# EAGLE schematic MiniBOT New (EAGLE 8.2.1)
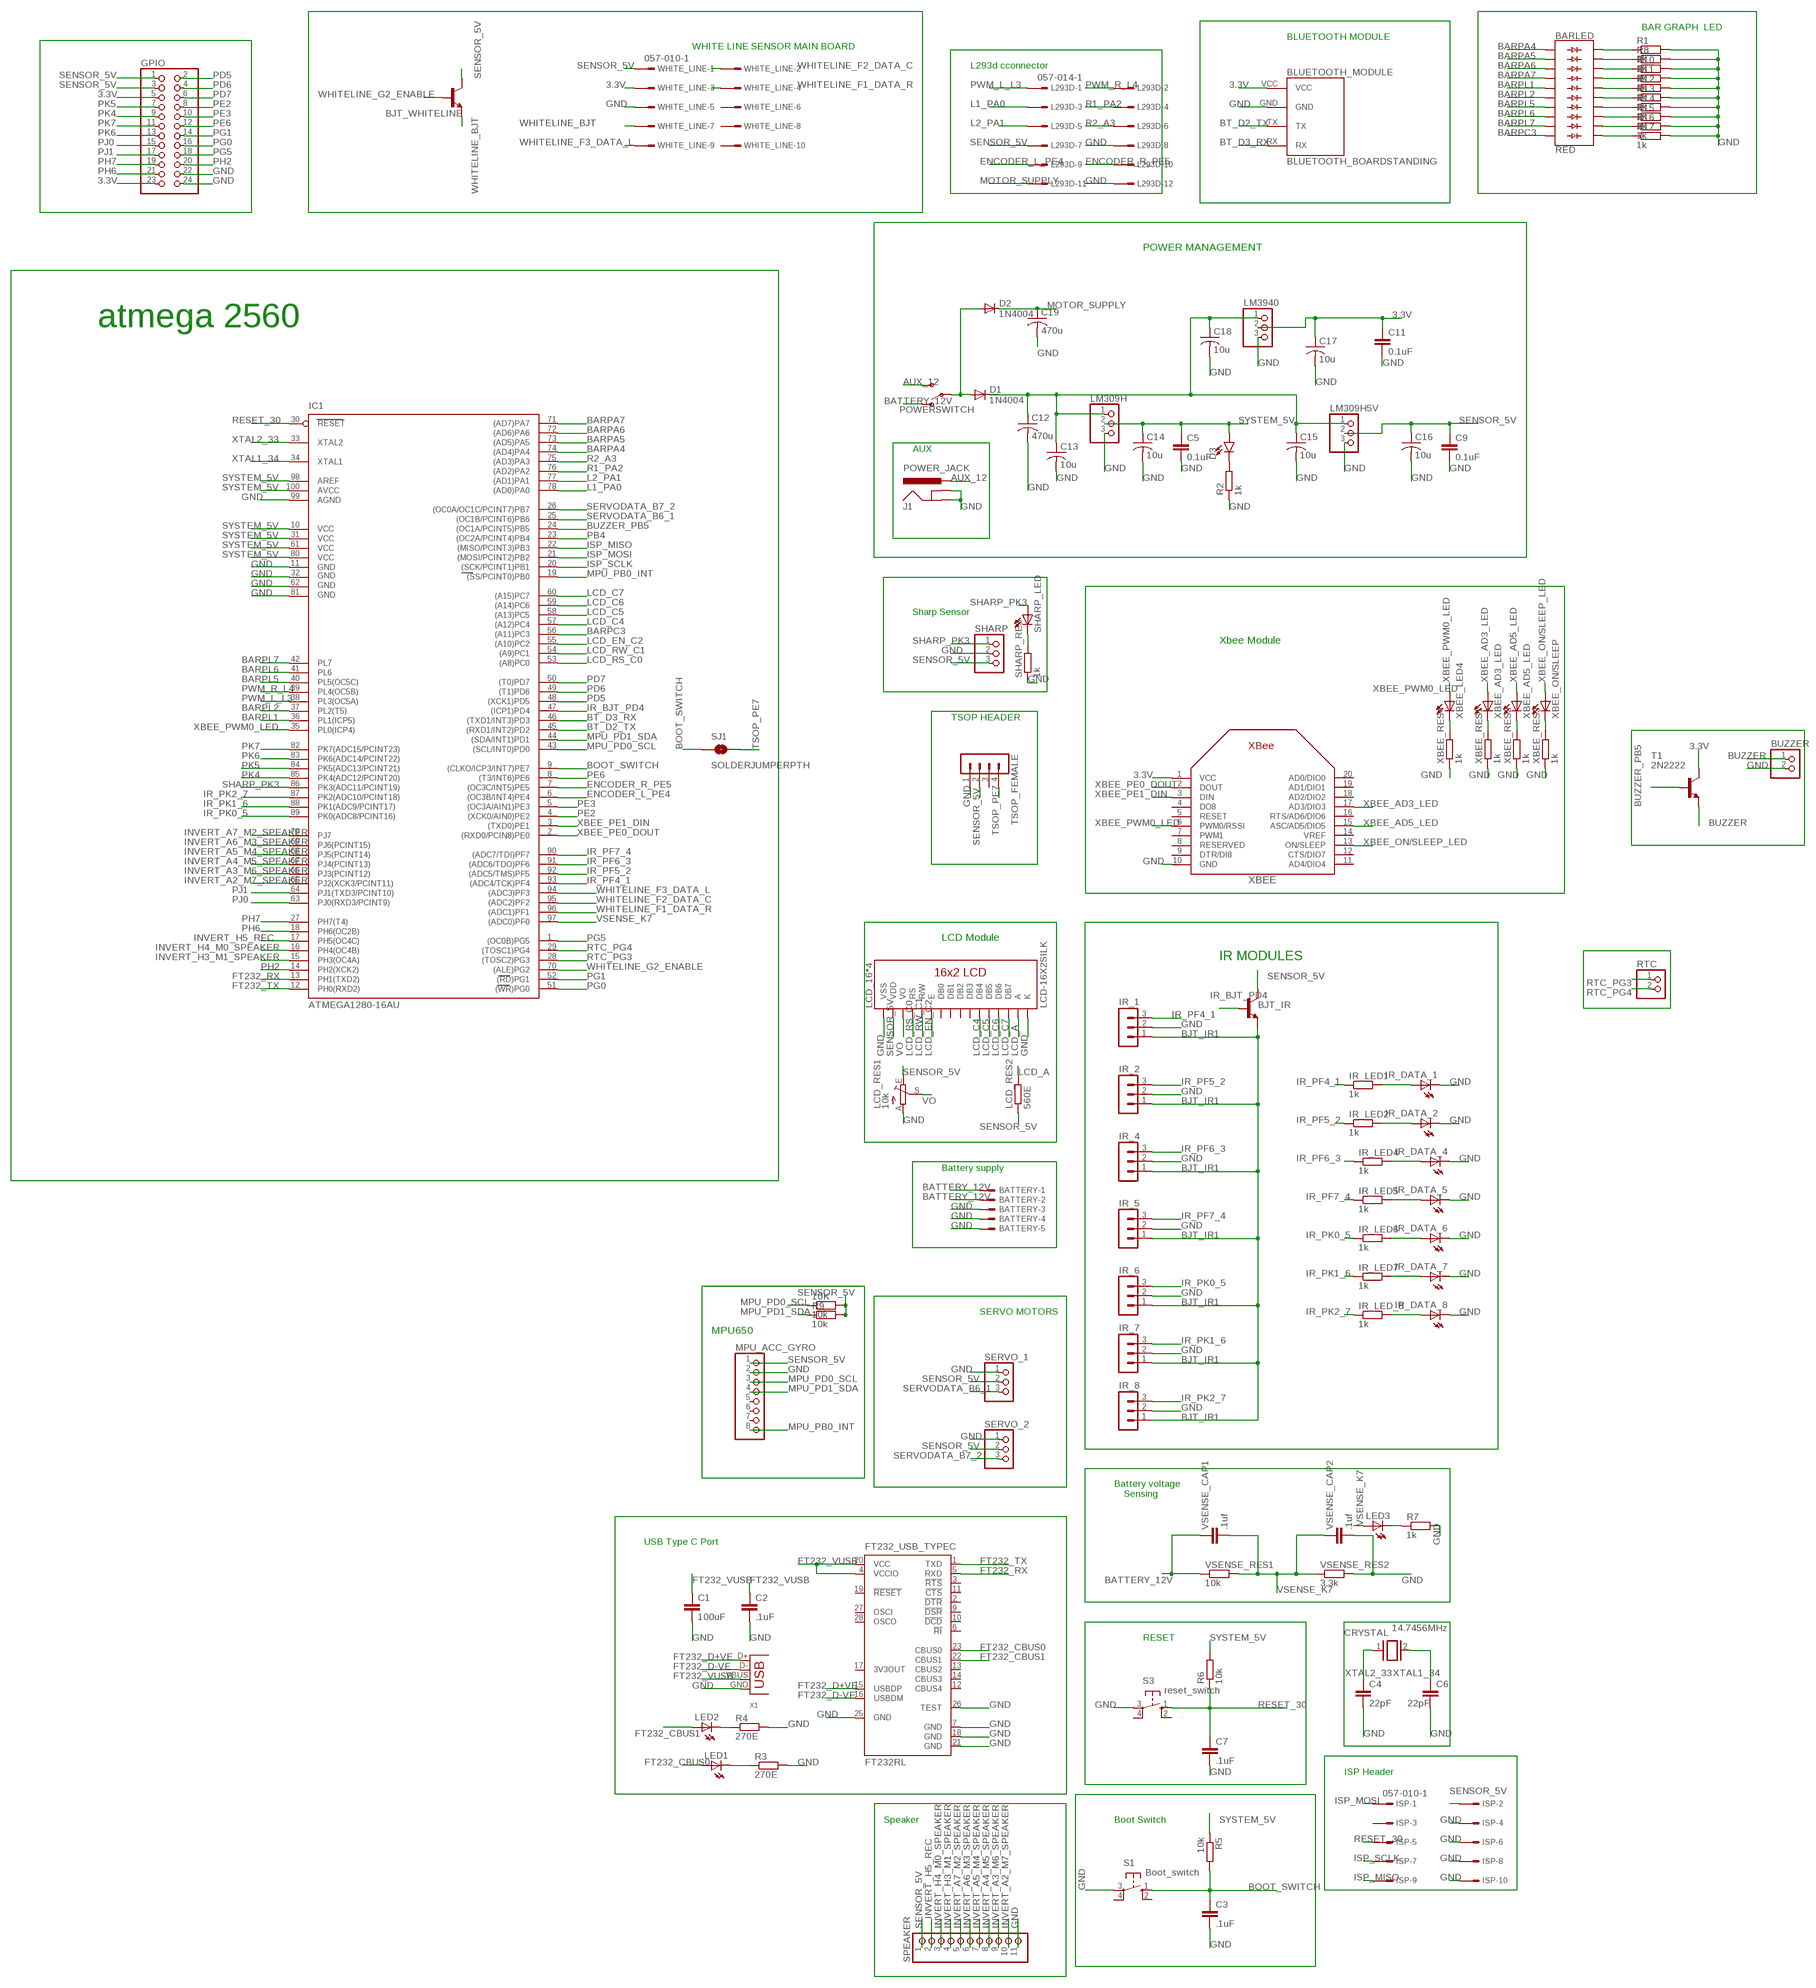
[diagram p0: schematic, sheet 1]

## Parts
10K  10k  R-EU_R1206  [R1206]
BARLED  RED  LED_BARGRAPH_10RED  [LED_BARGRAPH_10]
BATTERY  KK-156-5  [KK-156-5]
BJT_IR  2N2222  [TO92-EBC-OVAL]
BJT_WHITELINE  2N2222  [TO92-EBC-OVAL]
BLUETOOTH_MODULE  BLUETOOTH_BOARDSTANDING  [BT_BOARD_FOOTPRINT_STANDING]
BUZZER  PINHD-1X2  [1X02]
C1  100uF  C-EUC1206  [C1206]
C2  .1uF  C-EUC1206  [C1206]
C3  .1uF  C-EUC1206  [C1206]
C4  22pF  C-EUC1206  [C1206]
C5  0.1uF  C-EUC1206  [C1206]
C6  22pF  C-EUC1206  [C1206]
C7  .1uF  C-EUC1206  [C1206]
C9  0.1uF  C-EUC1206  [C1206]
C11  0.1uF  C-EUC1206  [C1206]
C12  470u  C-US025-050X050  [C025-050X050]
C13  10u  C-US025-050X050  [C025-050X050]
C14  10u  C-US025-050X050  [C025-050X050]
C15  10u  C-US025-050X050  [C025-050X050]
C16  10u  C-US025-050X050  [C025-050X050]
C17  10u  C-US025-050X050  [C025-050X050]
C18  10u  C-US025-050X050  [C025-050X050]
C19  470u  C-US025-050X050  [C025-050X050]
CRYSTAL  14.7456MHz  XTAL/S  [QS]
D1  1N4004  [DO41-10]
D2  1N4004  [DO41-10]
D3  LED1206  [LED-1206]
FT232_USB_TYPEC  FT232RL  [SSOP28]
GPIO  PINHD-2X12  [2X12]
IC1  ATMEGA1280-16AU  [TQFP100]
IR_1  MA03-1  [MA03-1]
IR_2  MA03-1  [MA03-1]
IR_4  MA03-1  [MA03-1]
IR_5  MA03-1  [MA03-1]
IR_6  MA03-1  [MA03-1]
IR_7  MA03-1  [MA03-1]
IR_8  MA03-1  [MA03-1]
IR_DATA_1  LEDSMT1206  [1206]
IR_DATA_2  LEDSMT1206  [1206]
IR_DATA_4  LEDSMT1206  [1206]
IR_DATA_5  LEDSMT1206  [1206]
IR_DATA_6  LEDSMT1206  [1206]
IR_DATA_7  LEDSMT1206  [1206]
IR_DATA_8  LEDSMT1206  [1206]
IR_LED1  1k  R-EU_R1206  [R1206]
IR_LED2  1k  R-EU_R1206  [R1206]
IR_LED4  1k  R-EU_R1206  [R1206]
IR_LED5  1k  R-EU_R1206  [R1206]
IR_LED6  1k  R-EU_R1206  [R1206]
IR_LED7  1k  R-EU_R1206  [R1206]
IR_LED_8  1k  R-EU_R1206  [R1206]
ISP  057-010-1  [057-010-1]
J1  POWER_JACK  [POWER_JACK_PTH]
L293D  057-014-1  [057-014-1]
LCD_16*4  LCD-16X2SILK  [LCD-16X2]
LCD_RES1  10k  TRIM_EU-CA6V  [CA6V]
LCD_RES2  560E  R-EU_R1206  [R1206]
LED1  LEDSMT1206  [1206]
LED2  LEDSMT1206  [1206]
LED3  LEDSMT1206  [1206]
LM309H  PINHD-1X3  [1X03]
LM309H5V  PINHD-1X3  [1X03]
LM3940  PINHD-1X3  [1X03]
MPU_ACC_GYRO  PINHD-1X8  [1X08]
POWERSWITCH  SWITCH-SPDT-PTH-11.6X4.0MM-LOCK  [SWITCH_SPDT_PTH_11.6X4.0MM_LOCK]
R1  1k  R-EU_R1206  [R1206]
R2  1k  R-EU_R1206  [R1206]
R3  270E  R-EU_R1206  [R1206]
R4  270E  R-EU_R1206  [R1206]
R5  10k  R-EU_R1206  [R1206]
R6  10k  R-EU_R1206  [R1206]
R7  1k  R-EU_R1206  [R1206]
R8  1k  R-EU_R1206  [R1206]
R9  10k  R-EU_R1206  [R1206]
R10  1k  R-EU_R1206  [R1206]
R11  1k  R-EU_R1206  [R1206]
R12  1k  R-EU_R1206  [R1206]
R13  1k  R-EU_R1206  [R1206]
R14  1k  R-EU_R1206  [R1206]
R15  1k  R-EU_R1206  [R1206]
R16  1k  R-EU_R1206  [R1206]
R17  1k  R-EU_R1206  [R1206]
RTC  PINHD-1X2  [1X02]
S1  Boot_switch  10-XX  [B3F-10XX]
S3  reset_switch  10-XX  [B3F-10XX]
SERVO_1  PINHD-1X3  [1X03]
SERVO_2  PINHD-1X3  [1X03]
SHARP  PINHD-1X3  [1X03]
SHARP_LED  LEDSMT1206  [1206]
SHARP_RES  1k  R-EU_R1206  [R1206]
SJ1  SOLDERJUMPERPTH  [SJ_2S-PTH]
SPEAKER  PINHD-1X11  [1X11]
T1  2N2222  [TO92-EBC-OVAL]
TSOP_FEMALE  MA04-1  [MA04-1]
VSENSE_CAP1  .1uf  C-EUC1206  [C1206]
VSENSE_CAP2  .1uf  C-EUC1206  [C1206]
VSENSE_RES1  10k  R-EU_R1206  [R1206]
VSENSE_RES2  3.3k  R-EU_R1206  [R1206]
WHITE_LINE  057-010-1  [057-010-1]
X1  USB-B-H  [USB-B-H]
XBEE  XBEE  [XBEE]
XBEE_AD3_LED  LEDSMT1206  [1206]
XBEE_AD5_LED  LEDSMT1206  [1206]
XBEE_LED4  LEDSMT1206  [1206]
XBEE_ON/SLEEP  LEDSMT1206  [1206]
XBEE_RES1  1k  R-EU_M1206  [M1206]
XBEE_RES2  1k  R-EU_M1206  [M1206]
XBEE_RES3  1k  R-EU_M1206  [M1206]
XBEE_RES4  1k  R-EU_M1206  [M1206]

## Nets
3.3V: BLUETOOTH_MODULE.VCC C11.1 C17.1 GPIO.5 GPIO.23 LM3940.2 T1.C WHITE_LINE.3 XBEE.1(VCC)
AUX_12: J1.PWR POWERSWITCH.3(S)
BARPA4: BARLED.1(A) IC1.74((AD4)PA4)
BARPA5: BARLED.2(A1) IC1.73((AD5)PA5)
BARPA6: BARLED.3(A2) IC1.72((AD6)PA6)
BARPA7: BARLED.4(A3) IC1.71((AD7)PA7)
BARPC3: BARLED.10(A9) IC1.56((A11)PC3)
BARPL1: BARLED.5(A4) IC1.36(PL1(ICP5))
BARPL2: BARLED.6(A5) IC1.37(PL2(T5))
BARPL5: BARLED.7(A6) IC1.40(PL5(OC5C))
BARPL6: BARLED.8(A7) IC1.41(PL6)
BARPL7: BARLED.9(A8) IC1.42(PL7)
BATTERY_12V: BATTERY.1 BATTERY.2 POWERSWITCH.1(O) VSENSE_CAP1.1 VSENSE_RES1.1
BJT_IR1: BJT_IR.E IR_1.1 IR_2.1 IR_4.1 IR_5.1 IR_6.1 IR_7.1 IR_8.1
BOOT_SWITCH: C3.1 IC1.9((CLKO/ICP3/INT7)PE7) R5.2 S1.1(S) SJ1.1
BT_D2_TX: BLUETOOTH_MODULE.TX IC1.45((RXD1/INT2)PD2)
BT_D3_RX: BLUETOOTH_MODULE.RX IC1.46((TXD1/INT3)PD3)
BUZZER: BUZZER.1 T1.E
BUZZER_PB5: IC1.24((OC1A/PCINT5)PB5) T1.B
CON1: IR_DATA_1.A IR_LED1.2
CON2: IR_DATA_2.A IR_LED2.2
CON4: IR_DATA_4.A IR_LED4.2
CON5: IR_DATA_5.A IR_LED5.2
CON6: IR_DATA_6.A IR_LED6.2
CON7: IR_DATA_7.A IR_LED7.2
CON8: IR_DATA_8.A IR_LED_8.2
ENCODER_L_PE4: IC1.6((OC3B/INT4)PE4) L293D.9
ENCODER_R_PE5: IC1.7((OC3C/INT5)PE5) L293D.10
FT232_CBUS0: FT232_USB_TYPEC.23(CBUS0) LED1.A
FT232_CBUS1: FT232_USB_TYPEC.22(CBUS1) LED2.A
FT232_D+VE: FT232_USB_TYPEC.15(USBDP) X1.D+
FT232_D-VE: FT232_USB_TYPEC.16(USBDM) X1.D-
FT232_RX: FT232_USB_TYPEC.5(RXD) IC1.13(PH1(TXD2))
FT232_TX: FT232_USB_TYPEC.1(TXD) IC1.12(PH0(RXD2))
FT232_VUSB: C1.1 C2.1 FT232_USB_TYPEC.4(VCCIO) FT232_USB_TYPEC.20(VCC) X1.VBUS
GND: BATTERY.3 BATTERY.4 BATTERY.5 BLUETOOTH_MODULE.GND BUZZER.2 C1.2 C2.2 C3.2 C4.2 C5.2 C6.2 C7.2 C9.2 C11.2 C12.2 C13.2 C14.2 C15.2 C16.2 C17.2 C18.2 C19.2 FT232_USB_TYPEC.7(GND) FT232_USB_TYPEC.18(GND) FT232_USB_TYPEC.21(GND) FT232_USB_TYPEC.25(GND) FT232_USB_TYPEC.26(TEST) GPIO.22 GPIO.24 IC1.11(GND) IC1.32(GND1) IC1.62(GND2) IC1.81(GND3) IC1.99(AGND) IR_1.2 IR_2.2 IR_4.2 IR_5.2 IR_6.2 IR_7.2 IR_8.2 IR_DATA_1.C IR_DATA_2.C IR_DATA_4.C IR_DATA_5.C IR_DATA_6.C IR_DATA_7.C IR_DATA_8.C ISP.4 ISP.6 ISP.8 ISP.10 J1.GND J1.GNDBREAK L293D.8 L293D.12 LCD_16*4.1(VSS) LCD_16*4.16(K) LCD_RES1.A LM309H5V.3 LM309H.3 LM3940.3 MPU_ACC_GYRO.2 R1.2 R2.1 R3.2 R4.2 R7.2 R8.2 R10.2 R11.2 R12.2 R13.2 R14.2 R15.2 R16.2 R17.2 S1.3(P) S3.3(P) SERVO_1.1 SERVO_2.1 SHARP.2 SHARP_RES.1 SPEAKER.11 TSOP_FEMALE.1 VSENSE_CAP2.2 VSENSE_RES2.2 WHITE_LINE.5 X1.GND XBEE.10(GND) XBEE_RES1.1 XBEE_RES2.1 XBEE_RES3.1 XBEE_RES4.1
INVERT_A2_M7_SPEAKER: IC1.65(PJ2(XCK3/PCINT11)) SPEAKER.10
INVERT_A3_M6_SPEAKER: IC1.66(PJ3(PCINT12)) SPEAKER.9
INVERT_A4_M5_SPEAKER: IC1.67(PJ4(PCINT13)) SPEAKER.8
INVERT_A5_M4_SPEAKER: IC1.68(PJ5(PCINT14)) SPEAKER.7
INVERT_A6_M3_SPEAKER: IC1.69(PJ6(PCINT15)) SPEAKER.6
INVERT_A7_M2_SPEAKER: IC1.79(PJ7) SPEAKER.5
INVERT_H3_M1_SPEAKER: IC1.15(PH3(OC4A)) SPEAKER.4
INVERT_H4_M0_SPEAKER: IC1.16(PH4(OC4B)) SPEAKER.3
INVERT_H5_REC: IC1.17(PH5(OC4C)) SPEAKER.2
IR_BJT_PD4: BJT_IR.B IC1.47((ICP1)PD4)
IR_PF4_1: IC1.93((ADC4/TCK)PF4) IR_1.3 IR_LED1.1
IR_PF5_2: IC1.92((ADC5/TMS)PF5) IR_2.3 IR_LED2.1
IR_PF6_3: IC1.91((ADC6/TDO)PF6) IR_4.3 IR_LED4.1
IR_PF7_4: IC1.90((ADC7/TDI)PF7) IR_5.3 IR_LED5.1
IR_PK0_5: IC1.89(PK0(ADC8/PCINT16)) IR_6.3 IR_LED6.1
IR_PK1_6: IC1.88(PK1(ADC9/PCINT17)) IR_7.3 IR_LED7.1
IR_PK2_7: IC1.87(PK2(ADC10/PCINT18)) IR_8.3 IR_LED_8.1
ISP_MISO: IC1.22((MISO/PCINT3)PB3) ISP.9
ISP_MOSI: IC1.21((MOSI/PCINT2)PB2) ISP.1
ISP_SCLK: IC1.20((SCK/PCINT1)PB1) ISP.7
L1_PA0: IC1.78((AD0)PA0) L293D.3
L2_PA1: IC1.77((AD1)PA1) L293D.5
LCD_A: LCD_16*4.15(A) LCD_RES2.2
LCD_C4: IC1.57((A12)PC4) LCD_16*4.11(DB4)
LCD_C5: IC1.58((A13)PC5) LCD_16*4.12(DB5)
LCD_C6: IC1.59((A14)PC6) LCD_16*4.13(DB6)
LCD_C7: IC1.60((A15)PC7) LCD_16*4.14(DB7)
LCD_EN_C2: IC1.55((A10)PC2) LCD_16*4.6(E)
LCD_RS_C0: IC1.53((A8)PC0) LCD_16*4.4(RS)
LCD_RW_C1: IC1.54((A9)PC1) LCD_16*4.5(R/W)
MOTOR_SUPPLY: C19.1 D2.C L293D.11
MPU_PB0_INT: IC1.19((SS/PCINT0)PB0) MPU_ACC_GYRO.8
MPU_PD0_SCL: 10K.1 IC1.43((SCL/INT0)PD0) MPU_ACC_GYRO.3
MPU_PD1_SDA: IC1.44((SDA/INT1)PD1) MPU_ACC_GYRO.4 R9.1
N$6: XBEE_LED4.C XBEE_RES4.2
N$8: D1.A D2.A POWERSWITCH.2(P)
N$9: XBEE_AD3_LED.C XBEE_RES1.2
N$10: XBEE_AD5_LED.C XBEE_RES2.2
N$11: XBEE_ON/SLEEP.C XBEE_RES3.2
N$19: LED1.C R3.1
N$20: LED2.C R4.1
N$28: LED3.C R7.1
N$30: C12.1 C13.1 C15.1 C18.1 D1.C LM309H5V.1 LM309H.1 LM3940.1
N$31: D3.C R2.2
N$35: SHARP_LED.C SHARP_RES.2
N$45: BARLED.11(C9) R17.1
N$46: BARLED.20(C) R1.1
N$47: BARLED.19(C1) R8.1
N$48: BARLED.18(C2) R10.1
N$49: BARLED.17(C3) R11.1
N$50: BARLED.16(C4) R12.1
N$51: BARLED.15(C5) R13.1
N$52: BARLED.14(C6) R14.1
N$53: BARLED.13(C7) R15.1
N$55: BARLED.12(C8) R16.1
PB4: IC1.23((OC2A/PCINT4)PB4)
PD5: GPIO.2 IC1.48((XCK1)PD5)
PD6: GPIO.4 IC1.49((T1)PD6)
PD7: GPIO.6 IC1.50((T0)PD7)
PE2: GPIO.8 IC1.4((XCK0/AIN0)PE2)
PE3: GPIO.10 IC1.5((OC3A/AIN1)PE3)
PE6: GPIO.12 IC1.8((T3/INT6)PE6)
PG0: GPIO.16 IC1.51((WR)PG0)
PG1: GPIO.14 IC1.52((RD)PG1)
PG5: GPIO.18 IC1.1((OC0B)PG5)
PH2: GPIO.20 IC1.14(PH2(XCK2))
PH6: GPIO.21 IC1.18(PH6(OC2B))
PH7: GPIO.19 IC1.27(PH7(T4))
PJ0: GPIO.15 IC1.63(PJ0(RXD3/PCINT9))
PJ1: GPIO.17 IC1.64(PJ1(TXD3/PCINT10))
PK4: GPIO.9 IC1.85(PK4(ADC12/PCINT20))
PK5: GPIO.7 IC1.84(PK5(ADC13/PCINT21))
PK6: GPIO.13 IC1.83(PK6(ADC14/PCINT22))
PK7: GPIO.11 IC1.82(PK7(ADC15/PCINT23))
PWM_L_L3: IC1.38(PL3(OC5A)) L293D.1
PWM_R_L4: IC1.39(PL4(OC5B)) L293D.2
R1_PA2: IC1.76((AD2)PA2) L293D.4
R2_A3: IC1.75((AD3)PA3) L293D.6
RESET_30: C7.1 IC1.30(RESET) ISP.5 R6.1 S3.1(S)
RTC_PG3: IC1.28((TOSC2)PG3) RTC.1
RTC_PG4: IC1.29((TOSC1)PG4) RTC.2
SENSOR_5V: 10K.2 BJT_IR.C BJT_WHITELINE.C C9.1 C16.1 GPIO.1 GPIO.3 ISP.2 L293D.7 LCD_16*4.2(VDD) LCD_RES1.E LCD_RES2.1 LM309H5V.2 MPU_ACC_GYRO.1 R9.2 SERVO_1.2 SERVO_2.2 SHARP.3 SPEAKER.1 TSOP_FEMALE.2 WHITE_LINE.1
SERVODATA_B6_1: IC1.25((OC1B/PCINT6)PB6) SERVO_1.3
SERVODATA_B7_2: IC1.26((OC0A/OC1C/PCINT7)PB7) SERVO_2.3
SHARP_PK3: IC1.86(PK3(ADC11/PCINT19)) SHARP.1 SHARP_LED.A
SYSTEM_5V: C5.1 C14.1 D3.A IC1.10(VCC) IC1.31(VCC1) IC1.61(VCC2) IC1.80(VCC3) IC1.98(AREF) IC1.100(AVCC) LM309H.2 R5.1 R6.2
TSOP_PE7: SJ1.2 TSOP_FEMALE.4
VO: LCD_16*4.3(VO) LCD_RES1.S
VSENSE_K7: IC1.97((ADC0)PF0) LED3.A VSENSE_CAP1.2 VSENSE_CAP2.1 VSENSE_RES1.2 VSENSE_RES2.1
WHITELINE_BJT: BJT_WHITELINE.E WHITE_LINE.7
WHITELINE_F1_DATA_R: IC1.96((ADC1)PF1) WHITE_LINE.4
WHITELINE_F2_DATA_C: IC1.95((ADC2)PF2) WHITE_LINE.2
WHITELINE_F3_DATA_L: IC1.94((ADC3)PF3) WHITE_LINE.9
WHITELINE_G2_ENABLE: BJT_WHITELINE.B IC1.70((ALE)PG2)
XBEE_AD3_LED: XBEE.17(AD3/DIO3) XBEE_AD3_LED.A
XBEE_AD5_LED: XBEE.15(ASC/AD5/DIO5) XBEE_AD5_LED.A
XBEE_ON/SLEEP_LED: XBEE.13(ON/SLEEP) XBEE_ON/SLEEP.A
XBEE_PE0_DOUT: IC1.2((RXD0/PCIN8)PE0) XBEE.2(DOUT)
XBEE_PE1_DIN: IC1.3((TXD0)PE1) XBEE.3(DIN)
XBEE_PWM0_LED: IC1.35(PL0(ICP4)) XBEE.6(PWM0/RSSI) XBEE_LED4.A
XTAL1_34: C6.1 CRYSTAL.2 IC1.34(XTAL1)
XTAL2_33: C4.1 CRYSTAL.1 IC1.33(XTAL2)
Unconnected: FT232_USB_TYPEC.2(!DTR) FT232_USB_TYPEC.3(!RTS) FT232_USB_TYPEC.6(!RI) FT232_USB_TYPEC.9(!DSR) FT232_USB_TYPEC.10(!DCD) FT232_USB_TYPEC.11(!CTS) FT232_USB_TYPEC.12(CBUS4) FT232_USB_TYPEC.13(CBUS2) FT232_USB_TYPEC.14(CBUS3) FT232_USB_TYPEC.17(3V3OUT) FT232_USB_TYPEC.19(!RESET) FT232_USB_TYPEC.27(OSCI) FT232_USB_TYPEC.28(OSCO) ISP.3 L293D.13 L293D.14 LCD_16*4.7(DB0) LCD_16*4.8(DB1) LCD_16*4.9(DB2) LCD_16*4.10(DB3) MPU_ACC_GYRO.5 MPU_ACC_GYRO.6 MPU_ACC_GYRO.7 S1.2(S1) S1.4(P1) S3.2(S1) S3.4(P1) TSOP_FEMALE.3 WHITE_LINE.6 WHITE_LINE.8 WHITE_LINE.10 XBEE.4(DO8) XBEE.5(RESET) XBEE.7(PWM1) XBEE.8(RESERVED) XBEE.9(DTR/DI8) XBEE.11(AD4/DIO4) XBEE.12(CTS/DIO7) XBEE.14(VREF) XBEE.16(RTS/AD6/DIO6) XBEE.18(AD2/DIO2) XBEE.19(AD1/DIO1) XBEE.20(AD0/DIO0)

## Notes on the sheet
- BAR GRAPH  LED
- BLUETOOTH MODULE
- WHITE LINE SENSOR MAIN BOARD
- L293d cconnector
- POWER MANAGEMENT
- atmega 2560
- AUX
- Sharp Sensor
- Xbee Module
- TSOP HEADER
- LCD Module
- IR MODULES
- Battery supply
- SERVO MOTORS
- MPU650
- Battery voltage 
      Sensing
- USB Type C Port
- RESET
- ISP Header
- Speaker | Boot Switch

## Library data of the parts
10K IR_LED1 IR_LED2 IR_LED4-IR_LED7 IR_LED_8 LCD_RES2 R1-R17 SHARP_RES VSENSE_RES1 VSENSE_RES2 XBEE_RES1-XBEE_RES4 = rcl:R-EU_: RESISTOR, European symbol
BARLED = SparkFun-LED:LED_BARGRAPH_10: Young Sun LED Tech - YSLB-10251G5-10 10-Segment LED Bar Graph Features: Red Vf = 2.1V, Ifmax = 20mA Yellow Vf = 2.1V, Ifmax = 20mA Blue Vf = 3.4V, Ifmax = 20mA Green Vf = 3.4V, Ifmax = 20mA SparkFun Products: Red <https://www.sparkfun.com/products/9935> Yellow <https://www.sparkfun.com/products/9936> Green <https://www.sparkfun.com/products/9938> Blue <https://www.sparkfun.com/products/9937>; PROD_ID: DIO-10615
BATTERY = con-molex:KK-156-5: KK 156 HEADER Source: http://www.molex.com/pdm_docs/sd/026604100_sd.pdf; OC_FARNELL: unknown; OC_NEWARK: unknown
BJT_IR BJT_WHITELINE T1 = adafruit:2N2222: NPN TRANSISTOR Big oval pads
BLUETOOTH_MODULE = Bluetooth HC-05:BLUETOOTH_BOARD: Bluetooth Board V1.05
BUZZER RTC = pinhead:PINHD-1X2: PIN HEADER
C1-C7 C9 C11 VSENSE_CAP1 VSENSE_CAP2 = rcl:C-EU: CAPACITOR, European symbol
C12-C19 = rcl:C-US: CAPACITOR, American symbol
CRYSTAL = special:XTAL/S: CRYSTAL
D1 D2 = adafruit:1N4004: DIODE General purpose 1N400x type rectifier (With bigger pads) http://www.ladyada.net/library/pcb/eaglelibrary.html
D3 = SparkFun-LED:LED: LED (Generic) Standard schematic elements and footprints for 5mm, 3mm, 1206, and 0603 sized LEDs. Generic LEDs with no color specified.
FT232_USB_TYPEC = ftdichip:FT232R: Source: http://www.ftdichip.com/Documents/DataSheets/DS_FT232R_v104.pdf; MPN: FT232RL; OC_FARNELL: 1146032; OC_NEWARK: 91K9918
GPIO = pinhead:PINHD-2X12: PIN HEADER
IC1 = atmel-2005:ATMEGA*: MICROCONTROLLER 64/128/256 Kbytes FLASH 4 Kbytes EEPROM 8 Kbytes SRAM 86 General Purpose I/O pins 12-channels16-bit PWM 4 x Serial USARTs 16-channels 10-bit A/D
IR_1 IR_2 IR_4-IR_8 = con-lstb:MA03-1: PIN HEADER; OC_FARNELL: unknown; OC_NEWARK: unknown
IR_DATA_1 IR_DATA_2 IR_DATA_4-IR_DATA_8 LED1-LED3 SHARP_LED XBEE_AD3_LED XBEE_AD5_LED XBEE_LED4 XBEE_ON/SLEEP = adafruit:LED: LED OSRAM: - CHIPLED LG R971, LG N971, LY N971, LG Q971, LY Q971, LO R971, LY R971 LH N974, LH R974 LS Q976, LO Q976, LY Q976 LO Q996 - Hyper CHIPLED LW Q18S LB Q993, LB Q99A, LB R99A - SideLED LS A670, LO A670, LY A670, LG A670, LP A670 LB A673, LV A673, LT A673, LW A673 LH A674 LY A675 LS A676, LA A676, LO A676, LY A676, LW A676 LS A679, LY A679, LG A679 - Hyper Micro SIDELED® LS Y876, LA Y876, LO Y876, LY Y876 LT Y87S - SmartLED LW L88C, LW L88S LB L89C, LB L89S, LG L890 LS L89K, LO L89K, LY L89K LS L896, LA L896, LO L896, LY L896 - TOPLED LS T670, LO T670, LY T670, LG T670, LP T670 LSG T670, LSP T670, LSY T670, LOP T670, LYG T670 LG T671, LOG T671, LSG T671 LB T673, LV T673, LT T673, LW T673 LH T674 LS T676, LA T676, LO T676, LY T676, LB T676, LH T676, LSB T676, LW T676 LB T67C, LV T67C, LT T67C, LS T67K, LO T67K, LY T67K, LW E67C LS E67B, LA E67B, LO E67B, LY E67B, LB E67C, LV E67C, LT E67C LW T67C LS T679, LY T679, LG T679 LS T770, LO T770, LY T770, LG T770, LP T770 LB T773, LV T773, LT T773, LW T773 LH T774 LS E675, LA E675, LY E675, LS T675 LS T776, LA T776, LO T776, LY T776, LB T776 LHGB T686 LT T68C, LB T68C - Hyper Mini TOPLED® LB M676 - Mini TOPLED Santana® LG M470 LS M47K, LO M47K, LY M47K Source: http://www.osram.convergy.de/
ISP WHITE_LINE = con-panduit:057-010-: CONNECTOR 10-pin series 057 contact pc board low profile headers; OC_FARNELL: unknown; OC_NEWARK: unknown
J1 = SparkFun-Connectors:POWER_JACK: Power Jack Connector This is the standard 5.5mm barrel jack for power. The PTH is the most common, proven, reliable, footprint. The Slot footprint only works if the mill layer is transmitted to the PCB fab house so be warned. Here are the connectors we sell at SparkFun: DC Barrel Power Jack/Connector <https://www.sparkfun.com/products/119> (PRT-00119) DC Barrel Power Jack/Connector (SMD) <https://www.sparkfun.com/products/12748> (PRT-12748) DC Barrel Jack Adapter - Breadboard Compatible <https://www.sparkfun.com/products/10811> (PRT-10811) It is used on this SparkFun product (and many, many others): SparkFun RedBoard - Programmed with Arduino <https://www.sparkfun.com/products/12757> (DEV-12757) Also, if you need a mating power supply or connector, please check these out: Wall Adapter Power Supply - 9VDC 650mA <https://www.sparkfun.com/products/298> (TOL-00298) DC Barrel Jack Adapter - Male <https://www.sparkfun.com/products/10287> (PRT-10287); PROD_ID: CONN-08197
L293D = con-panduit:057-014-: CONNECTOR 10-pin series 057 contact pc board low profile headers; OC_FARNELL: unknown; OC_NEWARK: unknown
LCD_16*4 = SparkFun-Displays:LCD-16X2: Standard text-only 16x2 parallel input LCD Basic 16 character by 2 line display. Typically utilizes the extremely common HD44780 parallel interface chipset SparkFun Products: Basic 16x2 Green <https://www.sparkfun.com/products/255> Basic 8x2 Green <https://www.sparkfun.com/products/11122>; SF_ID: LCD-00255
LCD_RES1 = pot:TRIM_EU-: POTENTIOMETER
LM309H LM309H5V LM3940 = adafruit:PINHD-1X3: PIN HEADER
MPU_ACC_GYRO = pinhead:PINHD-1X8: PIN HEADER
POWERSWITCH = SparkFun-Switches:SWITCH-SPDT: Single Pole, Double Throw (SPDT) Switch Single-pole, double-throw (SPDT) switch. Variant Overview SMD-AYZ0202 Surface Mount DPDT Switch <https://www.sparkfun.com/products/597> (COM-00597) Used on e.g. LilyPad Arduino USB - ATmega32U4 Board <https://www.sparkfun.com/products/12049> PTH-11.6X4.0MM SPDT Mini Power Switch <https://www.sparkfun.com/products/102> (COM-00102) Used on e.g. SparkFun Simon Says - Through-Hole Soldering Kit <https://www.sparkfun.com/products/10547> (KIT-10547) PTH-11.6X4.0MM-KIT KIT version of SPDT Mini Power Switch - Simplifies soldering by removing tStop of switch pins - only one side can be soldered. PTH-11.6X4.0MM-LOCK LOCK version of SPDT Mini Power Switch - Offset pins hold switch in place for easier soldering. SMD-RIGHT-ANGLE Surface Mount Right Angle Switch <https://www.sparkfun.com/products/10860> (COM-10860) Used on e.g. SparkFun ESP8266 Thing <https://www.sparkfun.com/products/13231>; PROD_ID: SWCH-08261; SF_SKU: COM-00102
S1 S3 = switch-omron:10-XX: OMRON SWITCH; MPN: B3F-1000; OC_FARNELL: 176432; OC_NEWARK: 36M3542
SERVO_1 SERVO_2 SHARP = pinhead:PINHD-1X3: PIN HEADER
SJ1 = SparkFun-Retired:SOLDERJUMPER: Solder Jumper Standard SMD solder jumper. Used to automate production. Two varients : Normally Open and Normally Closed are the same, but have different paste layers. NC will have a large amount of paste and should jumper during reflow.
SPEAKER = pinhead:PINHD-1X11: PIN HEADER
TSOP_FEMALE = con-lstb:MA04-1: PIN HEADER; OC_FARNELL: unknown; OC_NEWARK: unknown
X1 = con-usb-3:USB: USB Connectors
XBEE = adafruit:XBEE